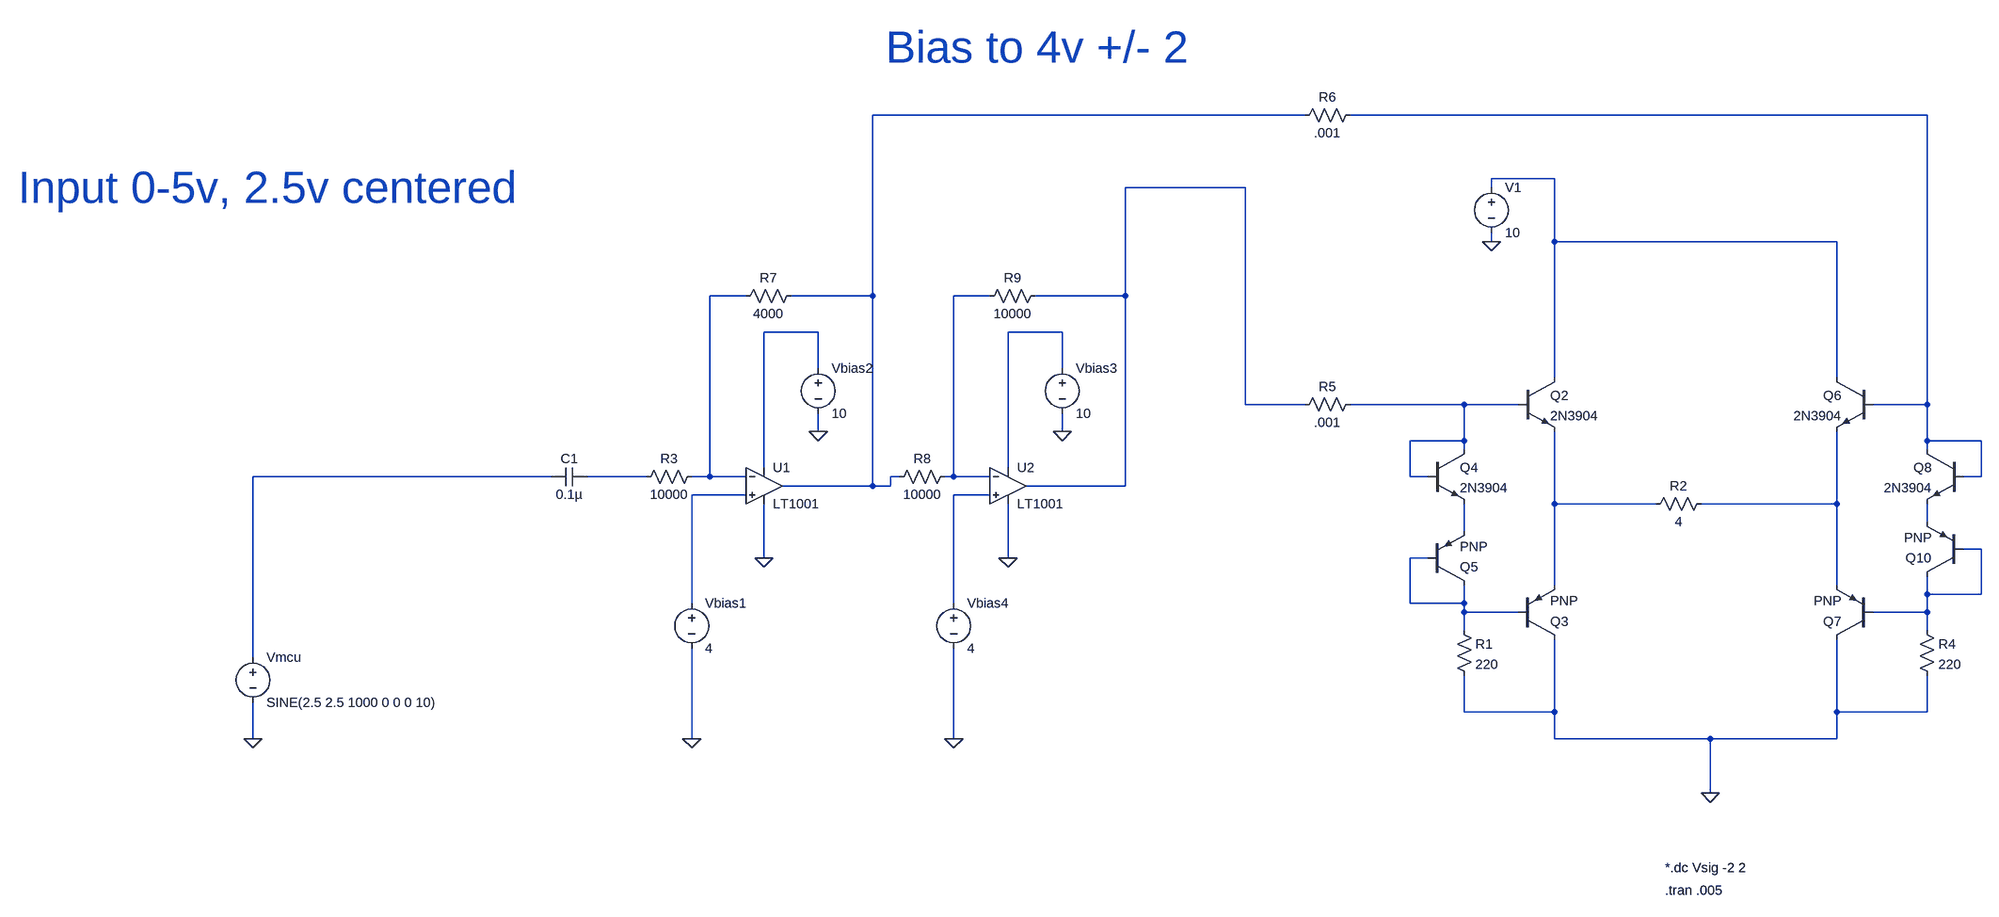
[diagram p0: schematic H-Bridge one With Preamp.asc]
H-Bridge one With Preamp.asc, the LTspice schematic file:
Version 4
SHEET 1 1828 900
WIRE 160 -624 -816 -624
WIRE 1360 -624 240 -624
WIRE 672 -512 560 -512
WIRE -144 -496 -368 -496
WIRE 560 -496 560 -512
WIRE 560 -400 560 -416
WIRE 672 -400 672 -512
WIRE 1200 -400 672 -400
WIRE -1040 -304 -1104 -304
WIRE -816 -304 -816 -624
WIRE -816 -304 -960 -304
WIRE -608 -304 -672 -304
WIRE -368 -304 -368 -496
WIRE -368 -304 -528 -304
WIRE -912 -240 -1008 -240
WIRE -480 -240 -576 -240
WIRE -912 -176 -912 -240
WIRE -480 -176 -480 -240
WIRE 672 -160 672 -400
WIRE 1200 -160 1200 -400
WIRE -144 -112 -144 -496
WIRE 160 -112 -144 -112
WIRE 512 -112 240 -112
WIRE 608 -112 512 -112
WIRE 1360 -112 1360 -624
WIRE 1360 -112 1264 -112
WIRE -912 -64 -912 -96
WIRE -480 -64 -480 -96
WIRE 512 -48 512 -112
WIRE 512 -48 416 -48
WIRE 1360 -48 1360 -112
WIRE 1456 -48 1360 -48
WIRE 512 -32 512 -48
WIRE 1360 -32 1360 -48
WIRE -1008 0 -1008 -240
WIRE -576 0 -576 -240
WIRE -1440 16 -1968 16
WIRE -1216 16 -1376 16
WIRE -1104 16 -1104 -304
WIRE -1104 16 -1136 16
WIRE -1040 16 -1104 16
WIRE -768 16 -784 16
WIRE -672 16 -672 -304
WIRE -672 16 -688 16
WIRE -608 16 -672 16
WIRE 416 16 416 -48
WIRE 448 16 416 16
WIRE 1456 16 1456 -48
WIRE 1456 16 1424 16
WIRE -816 32 -816 -304
WIRE -816 32 -976 32
WIRE -784 32 -784 16
WIRE -784 32 -816 32
WIRE -368 32 -368 -304
WIRE -368 32 -544 32
WIRE -1040 48 -1136 48
WIRE -608 48 -672 48
WIRE 672 64 672 -64
WIRE 880 64 672 64
WIRE 1200 64 1200 -64
WIRE 1200 64 960 64
WIRE 1360 96 1360 64
WIRE 512 112 512 64
WIRE 1456 144 1424 144
WIRE -1008 160 -1008 64
WIRE -576 160 -576 64
WIRE 448 160 416 160
WIRE 672 208 672 64
WIRE 1200 208 1200 64
WIRE 1360 224 1360 192
WIRE 1456 224 1456 144
WIRE 1456 224 1360 224
WIRE -1136 240 -1136 48
WIRE -672 240 -672 48
WIRE 416 240 416 160
WIRE 512 240 512 208
WIRE 512 240 416 240
WIRE 512 256 512 240
WIRE 608 256 512 256
WIRE 1360 256 1360 224
WIRE 1360 256 1264 256
WIRE 512 288 512 256
WIRE 1360 288 1360 256
WIRE -1968 336 -1968 16
WIRE 512 432 512 368
WIRE 672 432 672 304
WIRE 672 432 512 432
WIRE 1200 432 1200 304
WIRE 1360 432 1360 368
WIRE 1360 432 1200 432
WIRE -1968 480 -1968 416
WIRE -1136 480 -1136 320
WIRE -672 480 -672 320
WIRE 672 480 672 432
WIRE 976 480 672 480
WIRE 1200 480 1200 432
WIRE 1200 480 976 480
WIRE 976 576 976 480
FLAG 560 -400 0
FLAG 976 576 0
FLAG -1968 480 0
FLAG -1136 480 0
FLAG -912 -64 0
FLAG -1008 160 0
FLAG -480 -64 0
FLAG -576 160 0
FLAG -672 480 0
SYMBOL voltage 560 -512 R0
WINDOW 123 0 0 Left 2
WINDOW 39 0 0 Left 2
SYMATTR InstName V1
SYMATTR Value 10
SYMBOL npn 608 -160 R0
SYMATTR InstName Q2
SYMATTR Value 2N3904
SYMBOL res 864 80 R270
WINDOW 0 32 56 VTop 2
WINDOW 3 0 56 VBottom 2
SYMATTR InstName R2
SYMATTR Value 4
SYMBOL pnp 608 304 M180
SYMATTR InstName Q3
SYMBOL npn 448 -32 R0
SYMATTR InstName Q4
SYMATTR Value 2N3904
SYMBOL npn 1264 -160 M0
SYMATTR InstName Q6
SYMATTR Value 2N3904
SYMBOL pnp 1264 304 R180
SYMATTR InstName Q7
SYMBOL npn 1424 -32 M0
SYMATTR InstName Q8
SYMATTR Value 2N3904
SYMBOL res 496 272 R0
SYMATTR InstName R1
SYMATTR Value 220
SYMBOL res 1344 272 R0
SYMATTR InstName R4
SYMATTR Value 220
SYMBOL pnp 448 208 M180
SYMATTR InstName Q5
SYMBOL pnp 1424 192 R180
SYMATTR InstName Q10
SYMBOL res 144 -96 R270
WINDOW 0 32 56 VTop 2
WINDOW 3 0 56 VBottom 2
SYMATTR InstName R5
SYMATTR Value .001
SYMBOL res 144 -608 R270
WINDOW 0 32 56 VTop 2
WINDOW 3 0 56 VBottom 2
SYMATTR InstName R6
SYMATTR Value .001
SYMBOL Opamps\\LT1001 -1008 -32 R0
SYMATTR InstName U1
SYMBOL voltage -1968 320 R0
WINDOW 123 0 0 Left 2
WINDOW 39 0 0 Left 2
SYMATTR InstName Vmcu
SYMATTR Value SINE(2.5 2.5 1000 0 0 0 10)
SYMBOL res -1232 32 R270
WINDOW 0 32 56 VTop 2
WINDOW 3 0 56 VBottom 2
SYMATTR InstName R3
SYMATTR Value 10000
SYMBOL res -944 -320 R90
WINDOW 0 0 56 VBottom 2
WINDOW 3 32 56 VTop 2
SYMATTR InstName R7
SYMATTR Value 4000
SYMBOL voltage -1136 224 R0
WINDOW 123 0 0 Left 2
WINDOW 39 0 0 Left 2
SYMATTR InstName Vbias1
SYMATTR Value 4
SYMBOL voltage -912 -192 R0
WINDOW 123 0 0 Left 2
WINDOW 39 0 0 Left 2
SYMATTR InstName Vbias2
SYMATTR Value 10
SYMBOL cap -1440 32 R270
WINDOW 0 32 32 VTop 2
WINDOW 3 0 32 VBottom 2
SYMATTR InstName C1
SYMATTR Value 0.1µ
SYMBOL Opamps\\LT1001 -576 -32 R0
SYMATTR InstName U2
SYMBOL voltage -480 -192 R0
WINDOW 123 0 0 Left 2
WINDOW 39 0 0 Left 2
SYMATTR InstName Vbias3
SYMATTR Value 10
SYMBOL voltage -672 224 R0
WINDOW 123 0 0 Left 2
WINDOW 39 0 0 Left 2
SYMATTR InstName Vbias4
SYMATTR Value 4
SYMBOL res -784 32 R270
WINDOW 0 32 56 VTop 2
WINDOW 3 0 56 VBottom 2
SYMATTR InstName R8
SYMATTR Value 10000
SYMBOL res -624 -288 R270
WINDOW 0 32 56 VTop 2
WINDOW 3 0 56 VBottom 2
SYMATTR InstName R9
SYMATTR Value 10000
TEXT 896 728 Left 2 !*.dc Vsig -2 2
TEXT -792 -744 Left 6 ;Bias to 4v +/- 2
TEXT -2384 -496 Left 6 ;Input 0-5v, 2.5v centered
TEXT 896 768 Left 2 !.tran .005

The netlist it stands for:
* H-Bridge one With Preamp.asc
V1 N003 0 10
Q2 N003 N009 N014 0 2N3904
R2 N014 N015 4
Q3 0 N019 N014 0 PNP
Q4 N009 N009 N017 0 2N3904
Q6 N003 N002 N015 0 2N3904
Q7 0 N018 N015 0 PNP
Q8 N002 N002 N016 0 2N3904
R1 N019 0 220
R4 N018 0 220
Q5 N019 N019 N017 0 PNP
Q10 N018 N018 N016 0 PNP
R5 N004 N009 .001
R6 N001 N002 .001
XU1 N012 N005 N007 0 N001 LT1001  ; pins In+ In- V+ V- OUT
Vmcu N010 0 SINE(2.5 2.5 1000 0 0 0 10)
R3 N011 N005 10000
R7 N001 N005 4000
Vbias1 N012 0 4
Vbias2 N007 0 10
C1 N010 N011 0.1µ
XU2 N013 N006 N008 0 N004 LT1001  ; pins In+ In- V+ V- OUT
Vbias3 N008 0 10
Vbias4 N013 0 4
R8 N001 N006 10000
R9 N006 N004 10000
.model NPN NPN
.model PNP PNP
.lib standard.bjt
*.dc Vsig -2 2
* Bias to 4v +/- 2
* Input 0-5v, 2.5v centered
.tran .005
.lib LTC.lib
.backanno
.end